# Altium schematic sheet HIVE_SIGHT_POWER.SchDoc
size Tabloid; SheetNumber: 1; SheetTotal: 6; Sheet_Name: POWER; Size: 11x17
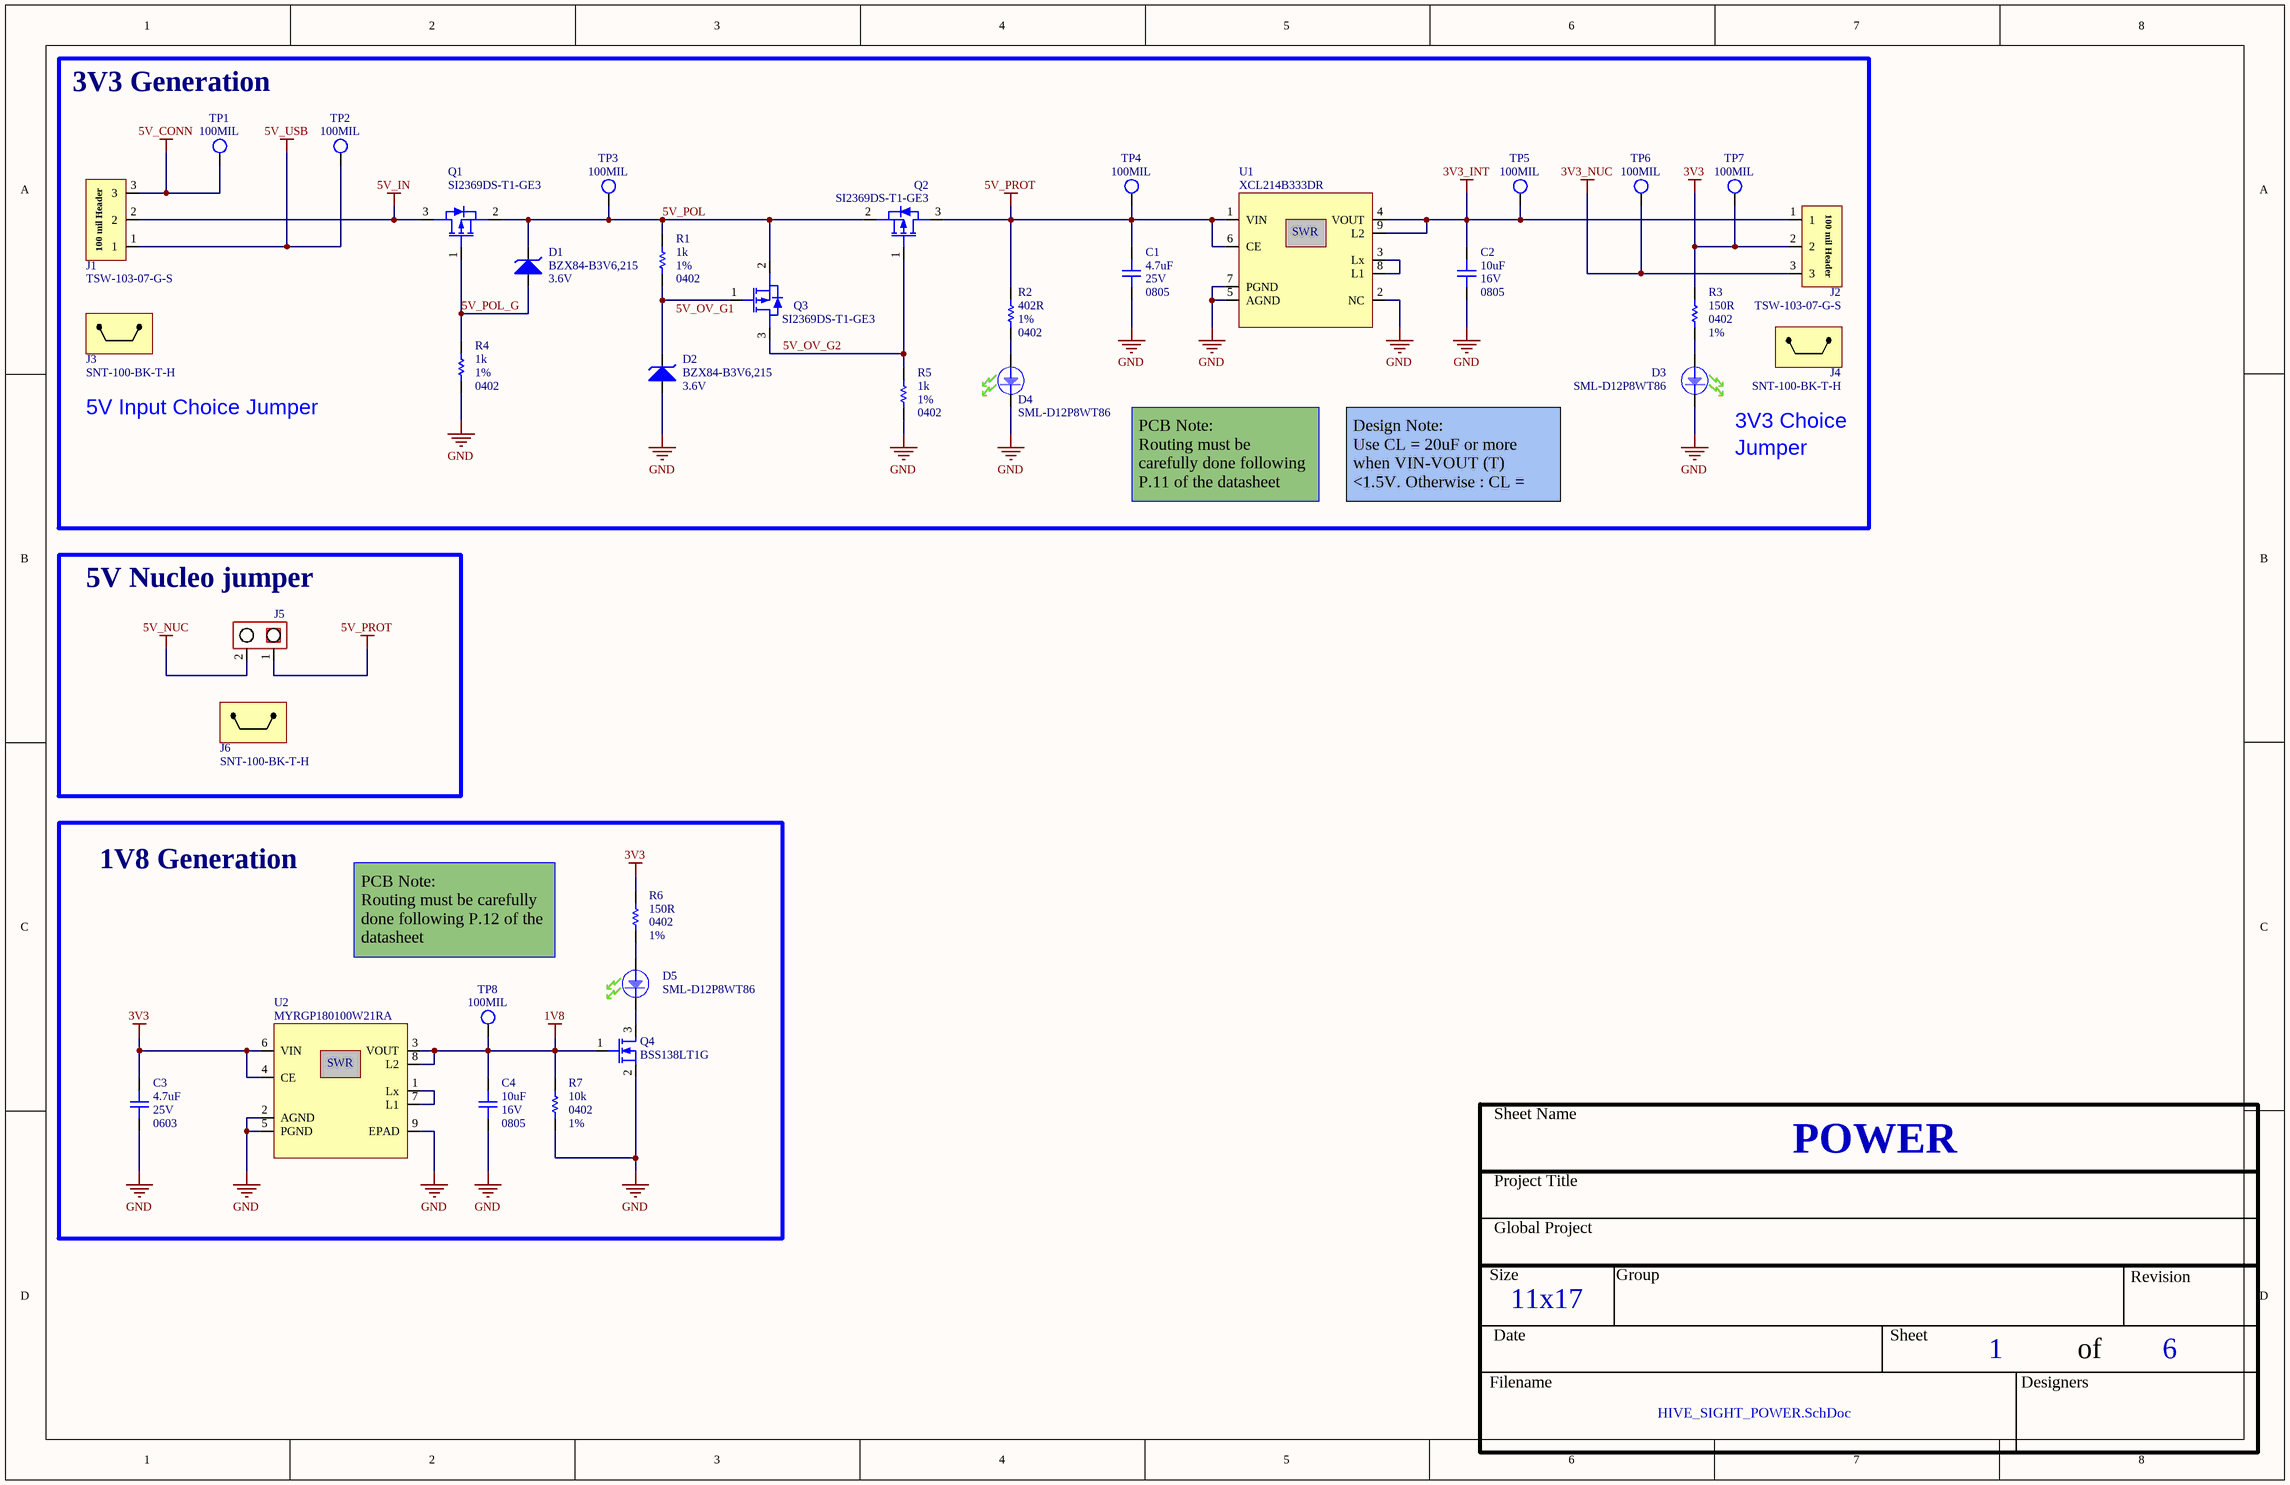
[diagram p0: HIVE_SIGHT_POWER.SchDoc]

## Parts
C1  value 4.7uF  Package: 0805  Voltage Rating: 25V  [CAP_CER_0805]  (hidden comment: C2012X7R1E475K125AE)
C2  value 10uF  Package: 0805  Voltage Rating: 16V  [CAP_CER_0805]  (hidden comment: GRM21BR61C106KE15K)
C3  value 4.7uF  Package: 0603  Voltage Rating: 25V  [CAP_CER_0603]  (hidden comment: CL10A475MA8NQNC)
C4  value 10uF  Package: 0805  Voltage Rating: 16V  [CAP_CER_0805]  (hidden comment: GRM21BR61C106KE15K)
D1  BZX84-B3V6,215  value 3.6V  [DIO_ZENER_BZX84-B3V6,215]
D2  BZX84-B3V6,215  value 3.6V  [DIO_ZENER_BZX84-B3V6,215]
D3  SML-D12P8WT86  [LED_SML-D12P8WT86]
D4  SML-D12P8WT86  [LED_SML-D12P8WT86]
D5  SML-D12P8WT86  [LED_SML-D12P8WT86]
J1  TSW-103-07-G-S  [CON_HDR_TSW-103-07-G-S]
J2  TSW-103-07-G-S  [CON_HDR_TSW-103-07-G-S]
J3  SNT-100-BK-T-H  [CON_JMP_SNT-100-BK-T-H]
J4  SNT-100-BK-T-H  [CON_JMP_SNT-100-BK-T-H]
J5  CON_HDR_1x2  [CON_HDR_1X2]  (value not drawn)
J6  SNT-100-BK-T-H  [CON_JMP_SNT-100-BK-T-H]
Q1  SI2369DS-T1-GE3  [TRX_PMOS_SI2369DS-T1-GE3]
Q2  SI2369DS-T1-GE3  [TRX_PMOS_SI2369DS-T1-GE3]
Q3  SI2369DS-T1-GE3  [TRX_PMOS_SI2369DS-T1-GE3]
Q4  BSS138LT1G  [TRX_NMOS_BSS138LT1G]
R1  value 1k  Tolerance: 1%  Package: 0402  [RES_0402]  (hidden comment: RC0402FR-071KL)
R2  value 402R  Tolerance: 1%  Package: 0402  [RES_0402]  (hidden comment: ERJ-2RKF4020X)
R3  value 150R  Tolerance: 1%  Package: 0402  [RES_0402]  (hidden comment: RC0402FR-07150RL)
R4  value 1k  Tolerance: 1%  Package: 0402  [RES_0402]  (hidden comment: RC0402FR-071KL)
R5  value 1k  Tolerance: 1%  Package: 0402  [RES_0402]  (hidden comment: RC0402FR-071KL)
R6  value 150R  Tolerance: 1%  Package: 0402  [RES_0402]  (hidden comment: RC0402FR-07150RL)
R7  value 10k  Tolerance: 1%  Package: 0402  [RES_0402]  (hidden comment: RC0402FR-0710KL)
TP1  100MIL  [TPO_TH_ROUND_100MIL]  (no BOM)
TP2  100MIL  [TPO_TH_ROUND_100MIL]  (no BOM)
TP3  100MIL  [TPO_TH_ROUND_100MIL]  (no BOM)
TP4  100MIL  [TPO_TH_ROUND_100MIL]  (no BOM)
TP5  100MIL  [TPO_TH_ROUND_100MIL]  (no BOM)
TP6  100MIL  [TPO_TH_ROUND_100MIL]  (no BOM)
TP7  100MIL  [TPO_TH_ROUND_100MIL]  (no BOM)
TP8  100MIL  [TPO_TH_ROUND_100MIL]  (no BOM)
U1  XCL214B333DR  [REG_SWR_XCL214B333DR]
U2  MYRGP180100W21RA  [REG_SWR_MYRGP180100W21RA]

## Blocks framed on the sheet
3V3 Generation: C1 C2 D1-D4 J1-J4 Q1-Q3 R1-R5 TP1-TP7 U1
5V Nucleo jumper: J5 J6
1V8 Generation: C3 C4 D5 Q4 R6 R7 TP8 U2

## Nets
1V8: C4.2 Q4.1(G) R7.1 TP8.1 U2.3(VOUT) U2.8(L2)
3V3: C3.2 J2.2 R3.1 R6.1 TP7.1 U2.4(CE) U2.6(VIN)
3V3_INT: C2.2 J2.1 TP5.1 U1.4(VOUT) U1.9(L2)
3V3_NUC: J2.3 TP6.1
5V_CONN: J1.3 TP1.1
5V_IN: J1.2 Q1.3(D)
5V_NUC: J5.2
5V_PROT: C1.2 J5.1 Q2.3(D) R2.2 TP4.1 U1.1(VIN) U1.6(CE)
5V_USB: J1.1 TP2.1
GND: C1.1 C2.1 C3.1 C4.1 D2.1(A) D3.K D4.K Q4.2(S) R4.2 R5.2 R7.2 U1.2(NC) U1.5(AGND) U1.7(PGND) U2.2(AGND) U2.5(PGND) U2.9(EPAD)
5V_OV_G1: D2.3(K) Q3.1(G) R1.2
5V_OV_G2: Q2.1(G) Q3.3(D) R5.1
5V_POL: D1.3(K) Q1.2(S) Q2.2(S) Q3.2(S) R1.1 TP3.1
5V_POL_G: D1.1(A) Q1.1(G) R4.1
NetD3_A: D3.A R3.2
NetD4_A: D4.A R2.1
NetD5_A: D5.A R6.2
NetD5_K: D5.K Q4.3(D)
NetU1_3: U1.3(Lx) U1.8(L1)
NetU2_1: U2.1(Lx) U2.7(L1)

Not connected (* = marked no-connect by the designer): D1 2(NC); D2 2(NC)

## Notes on the sheet
- 5V Input Choice Jumper
- (near D3) 3V3 Choice
- PCB Note:
  Routing must be carefully done following P.11 of the datasheet
- Design Note:
  Use CL = 20uF or more when VIN-VOUT (T) <1.5V. Otherwise : CL = 10uF
- Jumper
- PCB Note:
  Routing must be carefully done following P.12 of the datasheet
- Sheet Name
- Project Title
- Global Project
- Size
- Group
- Revision
- Date
- Sheet
- of
- Filename
- Designers
- (in symbol CON_HDR_TSW-103-07-G-S) 100 mil Header
- (in symbol REG_SWR_MYRGP180100W21RA) SWR
- (in symbol REG_SWR_XCL214B333DR) SWR

## Library data of the parts
C1 = CAP_CER_C2012X7R1E475K125AE: CAP - CER 4.7UF 10% 25V X7R - 0805; Manufacturer #1: TDK Corporation; GRAMS Lib Spec: 2.8; Magnetic Material: Unknown; Polarized: No; Tolerance: 10%; Current Rating: *; Power Max: *; HelpURL: https://product.tdk.com/info/en/documents/chara_sheet/C2012X7R1E475K125AE.pdf; CreatedBy/Date: Keven Deslandes - 2018/11/09; VerifiedBy: Nicolas Roy - 2018/12/11; Temperature: -55°C ~ 125°C; Manufacturer #2: *; Note: *; Assembly Type: SMD; Part Number #2: *; Part Number #1: C2012X7R1E475K125AE; Supplier 1: Digi-Key; Supplier Part Number 1: 445-14537-1-ND
C2 C4 = CAP_CER_GRM21BR61C106KE15K: CAP - CER 10UF 10% 16V X5R - 0805; Manufacturer #1: Murata; GRAMS Lib Spec: 2.8; Magnetic Material: Unknown; Polarized: NO; Assembly Type: SMD; CreatedBy/Date: Caroline Paulin / 8 août 2018; Current Rating: *; HelpURL: https://search.murata.co.jp/Ceramy/image/img/A01X/G101/ENG/GRM21BR61C106KE15-01.pdf; Manufacturer #2: *; Note: *; Part Number #1: GRM21BR61C106KE15K; Part Number #2: *; Power Max: *; Temperature: -55°C ~ 85°C; Tolerance: 10%; VerifiedBy: Nicolas V. (2019-01-22); Supplier 1: Digi-Key; Supplier Part Number 1: 490-6473-1-ND
C3 = CAP_CER_CL10A475MA8NQNC: CAP - CER 4.7µF 20% 25V X5R - 0603; Manufacturer #1: Samsung Electro-Mechanics; GRAMS Lib Spec: 2.8; Magnetic Material: Unknown; Polarized: NO; Assembly Type: SMD; CreatedBy/Date: Nicolas Roy 2018-11-21; Current Rating: *; HelpURL: http://www.samsungsem.com/kr/support/product-search/mlcc/__icsFiles/afieldfile/2018/06/20/CL10A475MA8NQNC.pdf; Manufacturer #2: *; Note: *; Part Number #1: CL10A475MA8NQNC; Part Number #2: *; Power Max: *; Temperature: -55°C ~ 85°C; Tolerance: 20%; VerifiedBy: Nicolas V. (2019-01-22); Supplier 1: Digi-Key; Supplier Part Number 1: 1276-1903-1-ND
D1 D2 = DIO_ZENER_BZX84-B3V6,215: DIO - ZENER 3.6V 250mW - SOT-23; Manufacturer #1: Nexperia USA Inc.; Current Rating: 70mA; GRAMS Lib Spec: 2.8; Magnetic Material: Unknown; Polarized: Yes; Tolerance: 2%; Assembly Type: SMD; CreatedBy/Date: Louis-Daniel Gaulin / 30-07-2020; HelpURL: https://assets.nexperia.com/documents/data-sheet/BZX84_SER.pdf; Manufacturer #2: -; Note: -; Package: SOT-23; Part Number #1: BZX84-B3V6,215; Part Number #2: -; Power Max: 250mW; Temperature: -65°C ~ 150°C; VerifiedBy: Philippe Arsenault/2020-11-06; Voltage Rating: 3.6V; Supplier 1: Digi-Key; Supplier Part Number 1: 1727-6252-1-ND; Cryo: UNKNOWN
D3-D5 = LED_SML-D12P8WT86: LED - GREEN DIFFUSED 0603 SMD - 0603; Manufacturer #1: Rohm Semiconductor; Current Rating: 1-20mA; Note: Operate at 2mA; Value: 560 nm (green); Voltage rating: 2.2V (Forward), 5V (max Reverse); Polarized: Yes; Magnetic Material: Unknown; GRAMS Lib Spec: 2.8; Manufacturer #2: *; Power Max: *; Part Number #1: SML-D12P8WT86; Part Number #2: *; HelpURL: https://d1d2qsbl8m0m72.cloudfront.net/en/products/databook/datasheet/opto/led/chip_mono/sml-d12x8_d13x8-e.pdf; Supplier 1: Digi-Key; Supplier Part Number 1: 511-1579-2-ND; Assembly Type: SMD; Temperature: -40 ~ 85 °C; Package: 0603; CreatedBy/Date: Keven Deslandes - 2018/11/21; Tolerance: *; VerifiedBy: Caroline Paulin - 13 février 2019; Cryo: UNKNOWN
J1 J2 = CON_HDR_TSW-103-07-G-S: CON - HDR 100 MIL 3 POS - TH; Manufacturer #1: Samtec; Value: 3 POS; Voltage Rating: 400-550 VAC; Current Rating: 4.3-6.3A; GRAMS Lib Spec: 2.8; Magnetic Material: YES; Polarized: NO; Tolerance: *; Power Max: *; HelpURL: http://suddendocs.samtec.com/catalog_english/tsw_th.pdf; CreatedBy/Date: Jonathan Bouchard; VerifiedBy: Arnaud Samson 16-07-18; Temperature: -55 °C to +125 °C; Package: 3-TH; Manufacturer #2: *; Note: *; Assembly Type: TH; Part Number #2: *; Part Number #1: TSW-103-07-G-S; Supplier 1: Samtec; Supplier Part Number 1: TSW-103-07-G-S
J3 J4 J6 = CON_JMP_SNT-100-BK-T-H: CON - CONN SHUNT - MEC; Manufacturer #1: Samtec Inc.; Voltage Rating: 450 VAC; Current Rating: 4.3A; GRAMS Lib Spec: 2.8; Magnetic Material: UNKNOWN; Polarized: NO; Value: *; Tolerance: *; Power Max: *; HelpURL: http://suddendocs.samtec.com/catalog_english/snt.pdf; CreatedBy/Date: Arnaud Samson - 09/07/18; VerifiedBy: Jonathan Bouchard 2018-07-12; Temperature: -55 °C to +125 °C; Package: MEC; Manufacturer #2: *; Note: *; Assembly Type: MANUAL; Part Number #2: *; Part Number #1: SNT-100-BK-T-H; Supplier 1: Digi-Key; Supplier Part Number 1: SAM8972-ND
J5 = CON_HDR_1X2: CON - Header 1x2 pins 100 mil -TH; Polarized: No; Magnetic Material: UNKNOWN; GRAMS Lib Spec: 2.8; Manufacturer #1: *; Current Rating: *; Power Max: *; Voltage Rating: *; Manufacturer #2: *; Note: *; Part Number #2: *; HelpURL: *; Package: TH; Assembly Type: TH; Temperature: *; CreatedBy/Date: Nicolas Roy/2 dec 2016; Tolerance: *; VerifiedBy: Caroline Paulin / 10 juillet 2018
Q1-Q3 = TRX_PMOS_SI2369DS-T1-GE3: TRX - PMOS 30V 7.6A - SOT−23; Manufacturer #1: Vishay Siliconix; GRAMS Lib Spec: 2.8; Magnetic Material: Unknown; Polarized: Yes; Power Max: 1.25W; Assembly Type: SMD; CreatedBy/Date: Louis-Daniel Gaulin / 30-07-2020; Current Rating: 7.6A; HelpURL: https://www.vishay.com/docs/62865/si2369d.pdf; Manufacturer #2: *; Package: SOT-23; Part Number #1: SI2369DS-T1-GE3; Part Number #2: *; Supplier 1: Digi-Key; Supplier Part Number 1: SI2369DS-T1-GE3CT-ND; Temperature: -55°C ~ 150°C; Tolerance: *; Value: *; VerifiedBy: Philippe Arsenault/2020-11-06; Voltage Rating: 30V; Cryo: UNKNOWN
Q4 = TRX_NMOS_BSS138LT1G: TRX - NMOS - 50V 200MA - SOT−23-3; Manufacturer #1: ON Semiconductor; GRAMS Lib Spec: 2.8; Magnetic Material: Unknown; Polarized: Yes; Power Max: 225mW; Assembly Type: SMD; CreatedBy/Date: Joel Lemay 2018-06-15; Current Rating: 200mA; HelpURL: http://www.onsemi.com/pub/Collateral/BSS138LT1-D.PDF; Manufacturer #2: *; Package: SOT-23-3; Part Number #1: BSS138LT1G; Part Number #2: *; Supplier 1: Digi-Key; Supplier Part Number 1: BSS138LT1GOSCT-ND; Temperature: -55°C ~ 150°C; Tolerance: *; Value: *; VerifiedBy: Caroline Paulin - 6 sept 2018; Voltage Rating: 50V
R1 R4 R5 = RES_RC0402FR-071KL: RES - 1K OHM 1% 1/16W - 0402; Manufacturer #1: Yageo; GRAMS Lib Spec: 2.8; Magnetic Material: YES; Polarized: NO; Voltage Rating: 50V; Cryo: UNKNOWN; Assembly Type: SMD; CreatedBy/Date: Jonathan Bouchard 2018-07-05; Current Rating: *; HelpURL: http://www.yageo.com/documents/recent/PYu-RC_Group_51_RoHS_L_9.pdf; Manufacturer #2: *; Note: *; Part Number #1: RC0402FR-071KL; Part Number #2: *; Power Max: 1/16W; Temperature: -55°C ~ 155°C; VerifiedBy: Arnaud Samson 16-07-18; Supplier 1: Digi-Key; Supplier Part Number 1: 311-1.00KLRCT-ND
R2 = RES_ERJ-2RKF4020X: RES - 402R 1% 1/10W - 0402; Manufacturer #1: Panasonic Electronic Components; GRAMS Lib Spec: 2.8; Magnetic Material: Unknown; Polarized: No; Voltage Rating: 50V; Assembly Type: SMD; CreatedBy/Date: Keven Deslandes 2018-09-20; Current Rating: *; HelpURL: https://industrial.panasonic.com/ww/products/resistors/chip-resistors/general-purpose-chip-resistors/precision-thick-film-chip-resistors/ERJ2RKF4020X; Manufacturer #2: *; Part Number #1: ERJ-2RKF4020X; Part Number #2: *; Power Max: 1/10W; Temperature: -55°C ~ 155°C; VerifiedBy: Caroline Paulin - 18/12/2018; Supplier 1: Digi-Key; Supplier Part Number 1: P402LCT-ND
R3 R6 = RES_RC0402FR-07150RL: RES - 150R 1% 1/16W - 0402; Manufacturer #1: Yageo; GRAMS Lib Spec: 2.8; Magnetic Material: Unknown; Polarized: No; Voltage Rating: 50V; Assembly Type: SMD; CreatedBy/Date: Jonathan Bouchard 2019-03-25; Current Rating: *; HelpURL: http://www.yageo.com/documents/recent/PYu-RC_Group_51_RoHS_L_10.pdf; Manufacturer #2: *; Part Number #1: RC0402FR-07150RL; Part Number #2: *; Power Max: 1/16W; Temperature: -55°C ~ 155°C; VerifiedBy: Nicolas V. (2019-05-02); Supplier 1: Digi-Key; Supplier Part Number 1: 311-150LRCT-ND; Cryo: UNKNOWN
R7 = RES_RC0402FR-0710KL: RES - 10K OHMS 1% 1/16W - 0402; Manufacturer #1: Yageo; GRAMS Lib Spec: 2.8; Magnetic Material: UNKNOWN; Polarized: NO; Voltage Rating: 50V; Assembly Type: SMD; CreatedBy/Date: Nicolas V. (2018-11-20); Current Rating: *; HelpURL: http://www.yageo.com/documents/recent/PYu-RC_Group_51_RoHS_L_9.pdf; Manufacturer #2: *; Note: *; Part Number #1: RC0402FR-0710KL; Part Number #2: *; Power Max: 1/16W; Temperature: -55°C ~ 155°C; VerifiedBy: Nicolas V. (2018-11-20); Supplier 1: Digi-Key; Supplier Part Number 1: 311-10.0KLRCT-ND; Cryo: UNKNOWN
TP1-TP8 = TPO_TH_ROUND_100MIL: TPO - TEST POINT ROUND TH  - 100MIL; Magnetic Material: NO; GRAMS Lib Spec: 2.8c; Cryo: UNKNOWN; Current Rating: *; Manufacturer #1: *; Manufacturer #2: *; Note: *; Power Max: *; Value: *; Part Number #1: *; Part Number #2: *; HelpURL: *; Polarized: *; Supplier 1: *; Assembly Type: NONE; Supplier Part Number 1: *; Package: 100 MIL round; CreatedBy/Date: Louis-Daniel Gaulin/ 14/01/2020; Temperature: *; Tolerance: *; VerifiedBy: C.Paulin - 21/01/2020; Voltage Rating: *
U1 = REG_SWR_XCL214B333DR: REG_DC DC CONVERTER 3.3V 5W_9-PowerTFQFN; Manufacturer #1: Torex Semiconductor Ltd; Voltage Rating: 2.7V to 5.5V IN; Current Rating: 1.5A; GRAMS Lib Spec: 2.8; Magnetic Material: Unknown; Polarized: Yes; Value: 3.3V; Tolerance: *; Power Max: *; HelpURL: https://www.torexsemi.com/file/xcl213/XCL213-XCL214.pdf; CreatedBy/Date: Louis-Daniel Gaulin / 21-07-2020; VerifiedBy: Philippe Arsenault/2020-11-06; Temperature: -40°C ~ 105°C; Package: 9-PowerTFQFN; Manufacturer #2: *; Note: *; Assembly Type: SMD; Part Number #2: *; Part Number #1: XCL214B333DR; Supplier 1: Digi-Key; Supplier Part Number 1: 893-1218-1-ND; Cryo: UNKNOWN
U2 = REG_SWR_MYRGP180100W21RA: REG_DC DC CONVERTER 1.8V 1.8W_8-PowerTDFN; Manufacturer #1: Murata Power Solutions Inc.; Voltage Rating: 2.5V to 5.5V IN; Current Rating: 1A; GRAMS Lib Spec: 2.8; Magnetic Material: Unknown; Polarized: Yes; Value: 1.8V; Tolerance: *; Power Max: *; HelpURL: https://www.murata.com/products/productdata/8807036026910/MYRGP-b-w.pdf?1583754814000; CreatedBy/Date: Louis-Daniel Gaulin / 21-07-2020; VerifiedBy: Philippe Arsenault/2020-11-06; Temperature: -40°C~105°C; Package: 8-PowerTDFN; Manufacturer #2: *; Note: *; Assembly Type: SMD; Part Number #2: *; Part Number #1: MYRGP180100W21RA; Supplier 1: Digi-Key; Supplier Part Number 1: 811-MYRGP180100W21RACT-ND; Cryo: UNKNOWN